# Altium schematic sheet system.SchDoc
size Letter
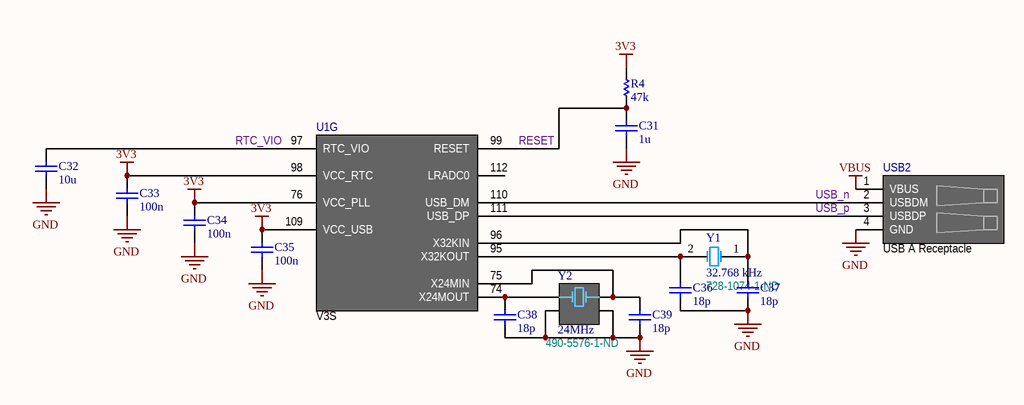
[diagram p0: system.SchDoc]

## Parts
C31  1u  [CAPC1005N]
C32  10u  [CAPC1608N]
C33  100n  [CAPC1005N]
C34  100n  [CAPC1005N]
C35  100n  [CAPC1005N]
C36  18p  [CAPC1005N]
C37  18p  [CAPC1005N]
C38  18p  [CAPC1005N]
C39  18p  [CAPC1005N]
R4  47k  [RESC1005N]
U1  V3S  [V3S]  (part G of 10)
USB2  USB A Receptacle  [USB2.0-4H4]
Y1  32.768 kHz  Supplier Part Number 1: 728-1074-1-ND  [ABS07]
Y2  24MHz  Supplier Part Number 1: 490-5576-1-ND  [XTAL3225-4-N]

## Nets
3V3: C33.2 C34.2 C35.2 R4.2 U1.76(VCC_PLL) U1.98(VCC_RTC) U1.109(VCC_USB)
GND: C31.1 C32.1 C33.1 C34.1 C35.1 C36.1 C37.1 C38.1 C39.1 USB2.4(GND) Y2.2 Y2.4
VBUS: USB2.1(VBUS)
RESET: C31.2 R4.1 U1.99(RESET)
RTC_VIO: C32.2 U1.97(RTC_VIO)
USB_n: U1.110(USB_DM) USB2.2(USBDM)
USB_p: U1.111(USB_DP) USB2.3(USBDP)
NetC36_2: C36.2 U1.95(X32KOUT) Y1.2(OSC2)
NetC37_2: C37.2 U1.96(X32KIN) Y1.1(OSC1)
NetC38_2: C38.2 U1.74(X24MOUT) Y2.1(OSC1)
NetC39_2: C39.2 U1.75(X24MIN) Y2.3(OSC2)

Not connected (* = marked no-connect by the designer): U1 112(LRADC0)

## Library data of the parts
C31-C39 = Cap Semi: Capacitor (Semiconductor SIM Model); Published: 8-Jun-2000; LatestRevisionDate: 29-May-2009; LatestRevisionNote: IPC-7351 Footprint Added.; PackageReference: C1206; Publisher: Altium Limited; PackageDescription: Chip Capacitor
  C36-C39: Supplier 1: Digi-Key; Supplier Part Number 1: 490-5921-1-ND
R4 = Res Semi: Semiconductor Resistor; Published: 8-Jun-2000; LatestRevisionDate: 17-Jul-2002; LatestRevisionNote: Re-released for DXP Platform.; PackageReference: AXIAL-0.5; Publisher: Altium Limited; PackageDescription: Axial Device, Thru-Hole; 2 Leads; 0.5 in Pin Spacing
Y1 = XTAL: Crystal Oscillator (2 pin); Published: 8-Jun-2000; LatestRevisionDate: 17-Jul-2002; LatestRevisionNote: Re-released for DXP Platform.; PackageReference: R38; Publisher: Altium Limited; PackageDescription: Crystal, Thru-Hole; 2 Leads; Body 3.1 x 8.2 mm (Dia.xH); Supplier 1: Digi-Key
Y2 = XTAL_4SMD: Crystal Oscillator (4 pin); Published: 8-Jun-2000; LatestRevisionDate: 17-Jul-2002; LatestRevisionNote: Re-released for DXP Platform.; PackageReference: R38; Publisher: Altium Limited; PackageDescription: Crystal, Thru-Hole; 2 Leads; Body 3.1 x 8.2 mm (Dia.xH); Supplier 1: Digi-Key